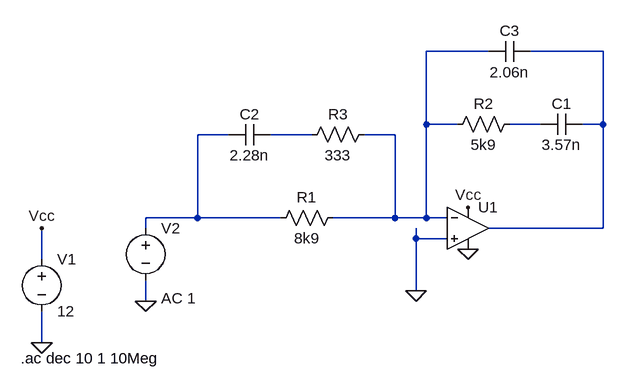
[diagram p0: schematic compensación.asc]
compensación.asc, the LTspice schematic file:
Version 4
SHEET 1 880 680
WIRE 528 -208 432 -208
WIRE 704 -208 592 -208
WIRE 432 -96 432 -208
WIRE 480 -96 432 -96
WIRE 608 -96 560 -96
WIRE 704 -96 704 -208
WIRE 704 -96 672 -96
WIRE 128 -80 80 -80
WIRE 256 -80 192 -80
WIRE 384 -80 336 -80
WIRE 80 48 80 -80
WIRE 80 48 0 48
WIRE 208 48 80 48
WIRE 384 48 384 -80
WIRE 384 48 288 48
WIRE 432 48 432 -96
WIRE 432 48 384 48
WIRE 464 48 432 48
WIRE 0 64 0 48
WIRE 704 64 704 -96
WIRE 704 64 528 64
WIRE 416 80 416 64
WIRE 464 80 416 80
WIRE -160 112 -160 64
WIRE 416 160 416 80
WIRE 0 176 0 144
WIRE -160 240 -160 192
FLAG -160 240 0
FLAG -160 64 Vcc
FLAG 496 32 Vcc
FLAG 496 96 0
FLAG 0 176 0
FLAG 416 160 0
SYMBOL OpAmps\\UniversalOpAmp2 496 64 R0
SYMATTR InstName U1
SYMBOL voltage -160 96 R0
WINDOW 123 0 0 Left 0
WINDOW 39 0 0 Left 0
SYMATTR InstName V1
SYMATTR Value 12
SYMBOL cap 192 -96 R90
WINDOW 0 0 32 VBottom 2
WINDOW 3 32 32 VTop 2
SYMATTR InstName C2
SYMATTR Value 2.28n
SYMBOL res 304 32 R90
WINDOW 0 0 56 VBottom 2
WINDOW 3 32 56 VTop 2
SYMATTR InstName R1
SYMATTR Value 8k9
SYMBOL res 352 -96 R90
WINDOW 0 0 56 VBottom 2
WINDOW 3 32 56 VTop 2
SYMATTR InstName R3
SYMATTR Value 333
SYMBOL res 576 -112 R90
WINDOW 0 0 56 VBottom 2
WINDOW 3 32 56 VTop 2
SYMATTR InstName R2
SYMATTR Value 5k9
SYMBOL cap 672 -112 R90
WINDOW 0 0 32 VBottom 2
WINDOW 3 32 32 VTop 2
SYMATTR InstName C1
SYMATTR Value 3.57n
SYMBOL cap 592 -224 R90
WINDOW 0 0 32 VBottom 2
WINDOW 3 32 32 VTop 2
SYMATTR InstName C3
SYMATTR Value 2.06n
SYMBOL voltage 0 48 R0
WINDOW 123 24 124 Left 2
WINDOW 39 0 0 Left 0
SYMATTR InstName V2
SYMATTR Value ""
SYMATTR Value2 AC 1
TEXT -192 264 Left 2 !.ac dec 10 1 10Meg

The netlist it stands for:
* compensación.asc
XU1 0 N001 Vcc 0 N002 level2 Avol=1Meg GBW=10Meg Slew=10Meg Ilimit=25m Rail=0 Vos=0 En=0 Enk=0 In=0 Ink=0 Rin=500Meg  ; pins In+ In- V+ V- OUT
V1 Vcc 0 12
C2 N005 N004 2.28n
R1 N001 N004 8k9
R3 N001 N005 333
R2 N003 N001 5k9
C1 N002 N003 3.57n
C3 N002 N001 2.06n
V2 N004 0 AC 1
.ac dec 10 1 10Meg
.lib UniversalOpAmp2.lib
.backanno
.end